# Altium project CW308T_ESP32_Target.PrjPcb
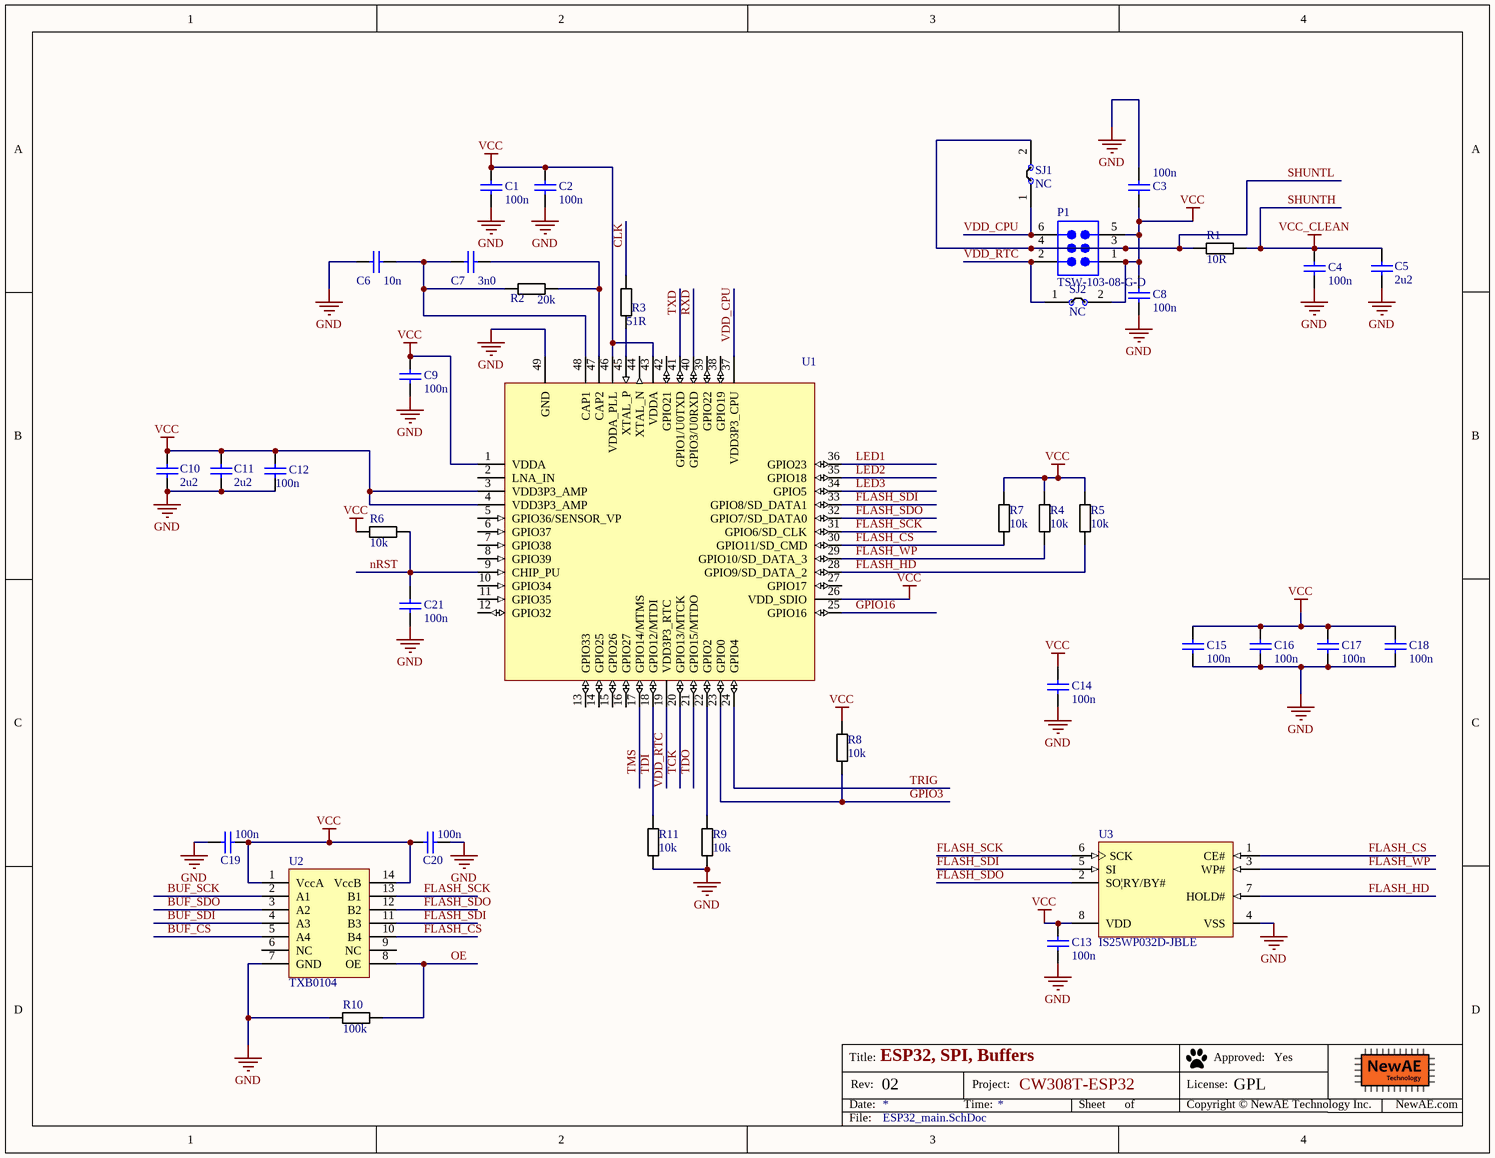
[diagram p0: ESP32_main.SchDoc]
PrjLicense: GPL; PrjName: CW308T-ESP32; PrjRev: 02
2 sheets, 39 parts. Net scope: global (net labels, ports and power ports of the same name join across sheets).
Board files: CW308T_ESP32_simple.PcbDoc, CW308T_ESP32_PANEL.PcbDoc
Sheets:
  ESP32_main.SchDoc
  ESP32_cw.SchDoc

## Sheet ESP32_main.SchDoc: ESP32, SPI, Buffers
size Letter; Organization: NewAE Technology Inc.; Address1: 1083 Queen St., Suite 196; Address2: Halifax; Address3: NS; Address4: Canada B3H 0B2; SheetApproved: Yes

### Parts
C1  100n  [CAPC0603_M]
C2  100n  [CAPC0603_M]
C3  100n  [CAPC0603_M]
C4  100n  [CAPC0603_M]
C5  2u2  [CAPC0603_M]
C6  10n  [CAPC0603_M]
C7  3n0  [CAPC0603_M]
C8  100n  [CAPC0603_M]
C9  100n  [CAPC0603_M]
C10  2u2  [CAPC0603_M]
C11  2u2  [CAPC0603_M]
C12  100n  [CAPC0603_M]
C13  100n  [CAPC0603_M]
C14  100n  [CAPC0603_M]
C15  100n  [CAPC0603_M]
C16  100n  [CAPC0603_M]
C17  100n  [CAPC0603_M]
C18  100n  [CAPC0603_M]
C19  100n  [CAPC0603_M]
C20  100n  [CAPC0603_M]
C21  100n  [CAPC0603_M]
P1  TSW-103-08-G-D  [SMTC-TSW-103-08-X-D]
R1  10R  [RESC1608X55N]
R2  20k  [RESC1608X55N]
R3  51R  [RESC1608X55N]
R4  10k  [RESC1608X55N]
R5  10k  [RESC1608X55N]
R6  10k  [RESC1608X55N]
R7  10k  [RESC1608X55N]
R8  10k  [RESC1608X55N]
R9  10k  [RESC1608X55N]
R10  100k  [RESC1608X55N]
R11  10k  [RESC1608X55N]
SJ1  NC  [SJ_2S_NC]  (no BOM)
SJ2  NC  [SJ_2S_NC]  (no BOM)
U1  ESP32  [QFN48_6x6_0.4mm]  (value not drawn)
U2  TXB0104  [SOIC14 (R-PDSO-G14)]
U3  IS25WP032D-JBLE  [SOIC8_WIDE_NARROW]

### Nets
GND: C1.2 C2.2 C3.1 C4.2 C5.2 C6.1 C8.2 C9.2 C10.2 C11.2 C12.2 C13.2 C14.2 C15.2 C16.2 C17.2 C18.2 C19.1 C20.2 C21.2 R9.2 R10.1 R11.2 U1.49(GND) U2.7(GND) U3.4(VSS)
SHUNTH: C4.1 C5.1 R1.2  [also labelled VCC_CLEAN]
VCC: C1.1 C2.1 C3.2 C8.1 C9.1 C10.1 C11.1 C12.1 C13.1 C14.1 C15.1 C16.1 C17.1 C18.1 C19.2 C20.1 P1.1 P1.5 R4.1 R5.1 R6.1 R7.1 R8.1 SJ2.2 U1.1(VDDA) U1.3(VDD3P3_AMP) U1.4(VDD3P3_AMP) U1.26(VDD_SDIO) U1.43(VDDA) U1.46(VDDA_PLL) U2.1(VccA) U2.14(VccB) U3.8(VDD)
BUF_CS: U2.5(A4)
BUF_SCK: U2.2(A1)
BUF_SDI: U2.4(A3)
BUF_SDO: U2.3(A2)
CLK: R3.1
FLASH_CS: R7.2 U1.30(GPIO11/SD_CMD) U2.10(B4) U3.1(CE#)
FLASH_HD: R5.2 U1.28(GPIO9/SD_DATA_2) U3.7(HOLD#)
FLASH_SCK: U1.31(GPIO6/SD_CLK) U2.13(B1) U3.6(SCK)
FLASH_SDI: U1.33(GPIO8/SD_DATA1) U2.11(B3) U3.5(SI)
FLASH_SDO: U1.32(GPIO7/SD_DATA0) U2.12(B2) U3.2(SO|RY/BY#)
FLASH_WP: R4.2 U1.29(GPIO10/SD_DATA_3) U3.3(WP#)
GPIO3: R8.2 U1.23(GPIO0)
GPIO16: U1.25(GPIO16)
LED1: U1.36(GPIO23)
LED2: U1.35(GPIO18)
LED3: U1.34(GPIO5)
nRST: C21.1 R6.2 U1.9(CHIP_PU)
OE: R10.2 U2.8(OE)
RXD: U1.40(GPIO3/U0RXD)
SHUNTL: P1.3 P1.4 R1.1 SJ1.2
TCK: U1.20(GPIO13/MTCK)
TDI: R11.1 U1.18(GPIO12/MTDI)
TDO: U1.21(GPIO15/MTDO)
TMS: U1.17(GPIO14/MTMS)
TRIG: U1.24(GPIO4)
TXD: U1.41(GPIO1/U0TXD)
VDD_CPU: P1.6 SJ1.1 U1.37(VDD3P3_CPU)
VDD_RTC: P1.2 SJ2.1 U1.19(VDD3P3_RTC)
NetC6_2: C6.2 C7.1 R2.1 U1.48(CAP1)
NetC7_2: C7.2 R2.2 U1.47(CAP2)
NetR3_2: R3.2 U1.45(XTAL_P)
NetR9_1: R9.1 U1.22(GPIO2)

Not connected (* = marked no-connect by the designer): U1 2(LNA_IN) 5(GPIO36/SENSOR_VP) 6(GPIO37) 7(GPIO38) 8(GPIO39) 10(GPIO34) 11(GPIO35) 12(GPIO32) 13(GPIO33) 14(GPIO25) 15(GPIO26) 16(GPIO27) 27(GPIO17) 38(GPIO19) 39(GPIO22) 42(GPIO21) 44(XTAL_N); U2 6(NC) 9(NC)

### Notes on the sheet
- Title:
- Date:
- Rev:
- Time:
- Project:
- Sheet
- of
- License:
- Copyright © NewAE Technology Inc.
- Approved:
- NewAE.com
- File:

### Library data of the parts
C1-C4 C8 C9 C12-C21 = CCHIP-100n-0603: 100n, 0603; Manufacture 1: Kemet; Manufacture Part Number 1: C0603C104K5RACTU; Case-EIA: 0603; Case-Metric: 1608; Component Group: Capacitor; Rated Voltage: 50V; Part Number: CCHIP-100n-0603; Component Kind: Standard; Component Type: Standard; Footprint: 0603; Pin Count: 2; Value: 100n; Mounting Technology: SMT; Supplier 1: Digi-Key; Supplier Part Number 1: 399-5089-2-ND
C5 C10 C11 = CCHIP-2u2-0603: 2u2, 0603; Manufacture Part Number 1: CL10B225KP8NNNC; Manufacture 1: Samsung; Case-EIA: 0603; Case-Metric: 1608; Component Group: Capacitor; Part Number: CCHIP-2u2-0603; Component Kind: Standard; Component Type: Standard; Footprint: 0603; Pin Count: 2; Value: 2u2; Mounting Technology: SMT; Supplier 1: Digi-Key; Supplier Part Number 1: 1276-1134-2-ND
C6 = CCHIP-10n-0603: 10n, 0603; Case-EIA: 0603; Case-Metric: 1608; Component Group: Capacitor; Part Number: CCHIP-10n-0603; Component Kind: Standard; Component Type: Standard; Footprint: 0603; Pin Count: 2; Value: 10n; Mounting Technology: SMT
C7 = CCHIP-3n0-0603: 3n0, 0603; Case-EIA: 0603; Case-Metric: 1608; Component Group: Capacitor; Part Number: CCHIP-3n0-0603; Component Kind: Standard; Component Type: Standard; Footprint: 0603; Pin Count: 2; Value: 3n0; Mounting Technology: SMT
P1 = CMP-1024-00338-1: Manufacturer: Samtec; Pitch: 2.54 mm; ComponentLink1URL: http://www.samtec.com; ComponentLink2URL: http://www.samtec.com/documents/webfiles/pdf/TSW_TH.PDF; Temperature Range: -55 to 125 degC; RoHS: True; ComponentLink2Description: Datasheet; PackageReference: TSW-103-08-X-D; ComponentLink3Description: Package Specification; PackageDescription: .025[0.64] SQ. Post Terminal Strip Assembly; DatasheetVersion: F-214; Mounting Technology: Through-hole; ComponentLink1Description: Manufacturer URL; Orientation: Vertical; PartNumber: TSW-103-08-G-D; PackageVersion: DM, 8/1988; ComponentLink3URL: http://www.samtec.com/documents/webfiles/cpdf/TSW-XXX-XX-XXX-X-XX-XXX-MKT.pdf
R1 = RCHIP-10R-0603: 10R res, 0603, 1%, 1/10W; Manufacture 1: Yageo; Manufacture Part Number 1: RC0603FR-0710RL; Case-EIA: 0603; Case-Metric: 1608; Rated Power: 0.1W; Rated Voltage: 75VDC; Component Group: Resistor; Part Number: RCHIP-10R-0603; Component Kind: Standard; Component Type: Standard; Footprint: 0603; Pin Count: 2; Supplier 1: Digi-Key; Supplier Part Number 1: 311-10.0HRCT-ND; Value: 10R; Tolerance: 1%; Mounting Technology: SMT; Temperature Range: -55C to 155C
R2 = RCHIP-20K-0603: 20k res, 0603, 1%, 1/10W; Manufacture 1: Yageo; Manufacture Part Number 1: RC0603FR-0720KL; Case-EIA: 0603; Case-Metric: 1608; Rated Power: 0.1W; Rated Voltage: 75VDC; Component Group: Resistor; Part Number: RCHIP-20K-0603; Component Kind: Standard; Component Type: Standard; Footprint: 0603; Pin Count: 2; Supplier 1: Digi-Key; Supplier Part Number 1: 311-20.0KHRCT-ND; Value: 20k; Tolerance: 1%; Mounting Technology: SMT; Temperature Range: -55C to 155C
R3 = RCHIP-51R-0603: 51R res, 0603, 1%, 1/10W; Manufacture 1: Yageo; Manufacture Part Number 1: RC0603FR-0751RL; Case-EIA: 0603; Case-Metric: 1608; Rated Power: 0.1W; Rated Voltage: 75VDC; Component Group: Resistor; Part Number: RCHIP-51R-0603; Component Kind: Standard; Component Type: Standard; Footprint: 0603; Pin Count: 2; Supplier 1: Digi-Key; Supplier Part Number 1: 311-51.0HRCT-ND; Value: 51R; Tolerance: 1%; Mounting Technology: SMT; Temperature Range: -55C to 155C
R4-R9 R11 = RCHIP-10K-0603: 10k res, 0603, 1%, 1/10W; Manufacture 1: Yageo; Manufacture Part Number 1: RC0603FR-0710KL; Case-EIA: 0603; Case-Metric: 1608; Rated Power: 0.1W; Rated Voltage: 75VDC; Component Group: Resistor; Part Number: RCHIP-10K-0603; Component Kind: Standard; Component Type: Standard; Footprint: 0603; Pin Count: 2; Supplier 1: Digi-Key; Supplier Part Number 1: 311-10.0KHRCT-ND; Value: 10k; Tolerance: 1%; Mounting Technology: SMT; Temperature Range: -55C to 155C
R10 = RCHIP-100K-0603: 100k res, 0603, 1%, 1/10W; Manufacture 1: Yageo; Manufacture Part Number 1: RC0603FR-07100KL; Component Group: Resistor; Case-EIA: 0603; Case-Metric: 1608; Rated Power: 0.1W; Rated Voltage: 75VDC; Part Number: RCHIP-100K-0603; Footprint: 0603; Pin Count: 2; Supplier 1: Digi-Key; Supplier Part Number 1: 311-100KHRCT-ND; Value: 100k; Tolerance: 1%; Mounting Technology: SMT; Temperature Range: -55C to 155C; Component Kind: Standard; Component Type: Standard
SJ1 SJ2 = SJ_2S: Solder Jumper, NC; Component Group: PCB Feature; Part Number: SJ_2S; Pin Count: 2; Mounting Technology: COPPER; Component Type: Standard (No BOM)
U1 = ESP32: Dual-Core WiFi/Bluetooth Chip; Component Group: Digital IC; Part Number: ESP32; Component Kind: Standard; Component Type: Standard; Footprint: QFN48_HAND; Pin Count: 48; Mounting Technology: SMT
U2 = TXB0104DR: IC 4BIT NON-INV TRANSLTR 14-SOIC; Manufacture 1: Texas Instruments; Component Group: Digital IC; PP Material Stack: 0; Part Number: TXB0104DR; Manufacture Part Number 1: TXB0104DR; Pin Count: 14; Supplier 1: Digi-Key; Supplier Part Number 1: 296-21928-1-ND; Mounting Technology: SMT; RoHS: Yes; Component Kind: Standard; Component Type: Standard; PP Rotation: 0
U3 = IS25WP032D-JBLE: 32MB QPI/QPI/QSPI 8-PIN SOP 208M; Manufacture 1: ISSI; Component Group: Digital IC; Pitch: 1.27mm; Part Number: IS25WP032D-JBLE; Component Kind: Standard; Component Type: Standard; Footprint: SOIC8_WIDE; Manufacture Part Number 1: IS25WP032D-JBLE; Pin Count: 8; Supplier 1: Digi-Key; Supplier Part Number 1: 706-1615-ND; Mounting Technology: SMT; RoHS: Yes

## Sheet ESP32_cw.SchDoc: UFO Connections
size Letter; Organization: NewAE Technology Inc.; Address1: 1083 Queen St., Suite 196; Address2: Halifax; Address3: NS; Address4: Canada B3H 0B2; SheetApproved: Yes
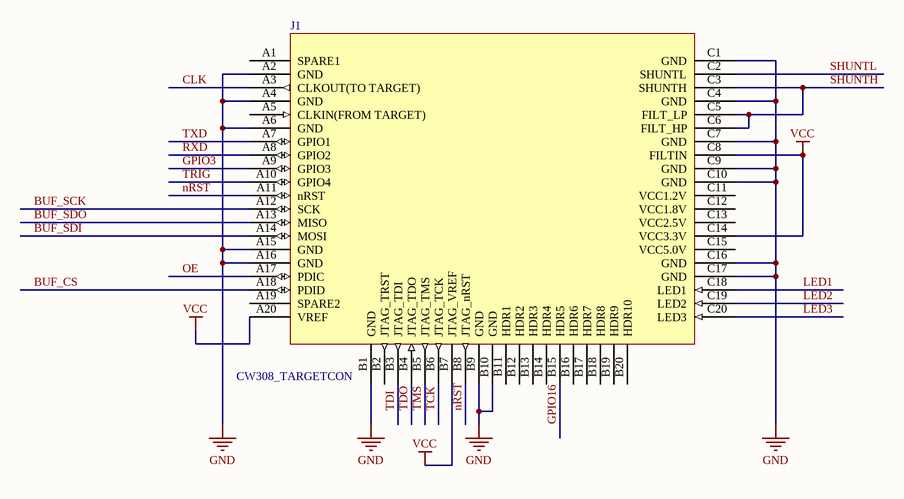
[diagram p1: ESP32_cw.SchDoc]

### Parts
J1  CW308_TARGETCON  [CW308_TBOARD_CONN]

### Nets
GND: J1.A2(GND) J1.A4(GND) J1.A6(GND) J1.A15(GND) J1.A16(GND) J1.B1(GND) J1.B9(GND) J1.B10(GND) J1.C1(GND) J1.C4(GND) J1.C7(GND) J1.C9(GND) J1.C10(GND) J1.C16(GND) J1.C17(GND)
SHUNTH: J1.C3(SHUNTH) J1.C5(FILT_LP) J1.C6(FILT_HP)
VCC: J1.A20(VREF) J1.B7(JTAG_VREF) J1.C8(FILTIN) J1.C14(VCC3.3V)
BUF_CS: J1.A18(PDID)
BUF_SCK: J1.A12(SCK)
BUF_SDI: J1.A14(MOSI)
BUF_SDO: J1.A13(MISO)
CLK: J1.A3(CLKOUT(TO_TARGET))
GPIO3: J1.A9(GPIO3)
GPIO16: J1.B15(HDR5)
LED1: J1.C18(LED1)
LED2: J1.C19(LED2)
LED3: J1.C20(LED3)
nRST: J1.A11(nRST) J1.B8(JTAG_nRST)
OE: J1.A17(PDIC)
RXD: J1.A8(GPIO2)
SHUNTL: J1.C2(SHUNTL)
TCK: J1.B6(JTAG_TCK)
TDI: J1.B3(JTAG_TDI)
TDO: J1.B4(JTAG_TDO)
TMS: J1.B5(JTAG_TMS)
TRIG: J1.A10(GPIO4)
TXD: J1.A7(GPIO1)

Not connected (* = marked no-connect by the designer): J1 A1(SPARE1) A5(CLKIN(FROM_TARGET)) A19(SPARE2) B2(JTAG_TRST) B11(HDR1) B12(HDR2) B13(HDR3) B14(HDR4) B16(HDR6) B17(HDR7) B18(HDR8) B19(HDR9) B20(HDR10) C11(VCC1.2V) C12(VCC1.8V) C13(VCC2.5V) C15(VCC5.0V)

### Notes on the sheet
- Title:
- Date:
- Rev:
- Time:
- Project:
- Sheet
- of
- License:
- Copyright © NewAE Technology Inc.
- Approved:
- NewAE.com
- File:

### Library data of the parts
J1 = CW308_TBOARD: CW308 "Standard" Target Board Connector; Pitch: 2.54mm; Component Group: Mechanical; Part Number: CW308_TBOARD; Component Kind: Standard; Component Type: Standard; Pin Count: 60; Mounting Technology: Through-hole

## Nets that join several sheets
GND: ESP32_main (26 pins), ESP32_cw (15 pins)
SHUNTH: ESP32_main (C4.1 C5.1 R1.2), ESP32_cw (J1.C3 J1.C5 J1.C6)
VCC: ESP32_main (33 pins), ESP32_cw (J1.A20 J1.B7 J1.C8 J1.C14)
BUF_CS: ESP32_main (U2.5), ESP32_cw (J1.A18)
BUF_SCK: ESP32_main (U2.2), ESP32_cw (J1.A12)
BUF_SDI: ESP32_main (U2.4), ESP32_cw (J1.A14)
BUF_SDO: ESP32_main (U2.3), ESP32_cw (J1.A13)
CLK: ESP32_main (R3.1), ESP32_cw (J1.A3)
GPIO3: ESP32_main (R8.2 U1.23), ESP32_cw (J1.A9)
GPIO16: ESP32_main (U1.25), ESP32_cw (J1.B15)
LED1: ESP32_main (U1.36), ESP32_cw (J1.C18)
LED2: ESP32_main (U1.35), ESP32_cw (J1.C19)
LED3: ESP32_main (U1.34), ESP32_cw (J1.C20)
nRST: ESP32_main (C21.1 R6.2 U1.9), ESP32_cw (J1.A11 J1.B8)
OE: ESP32_main (R10.2 U2.8), ESP32_cw (J1.A17)
RXD: ESP32_main (U1.40), ESP32_cw (J1.A8)
SHUNTL: ESP32_main (P1.3 P1.4 R1.1 SJ1.2), ESP32_cw (J1.C2)
TCK: ESP32_main (U1.20), ESP32_cw (J1.B6)
TDI: ESP32_main (R11.1 U1.18), ESP32_cw (J1.B3)
TDO: ESP32_main (U1.21), ESP32_cw (J1.B4)
TMS: ESP32_main (U1.17), ESP32_cw (J1.B5)
TRIG: ESP32_main (U1.24), ESP32_cw (J1.A10)
TXD: ESP32_main (U1.41), ESP32_cw (J1.A7)